# EAGLE design wmrp (EAGLE 7.7.0)
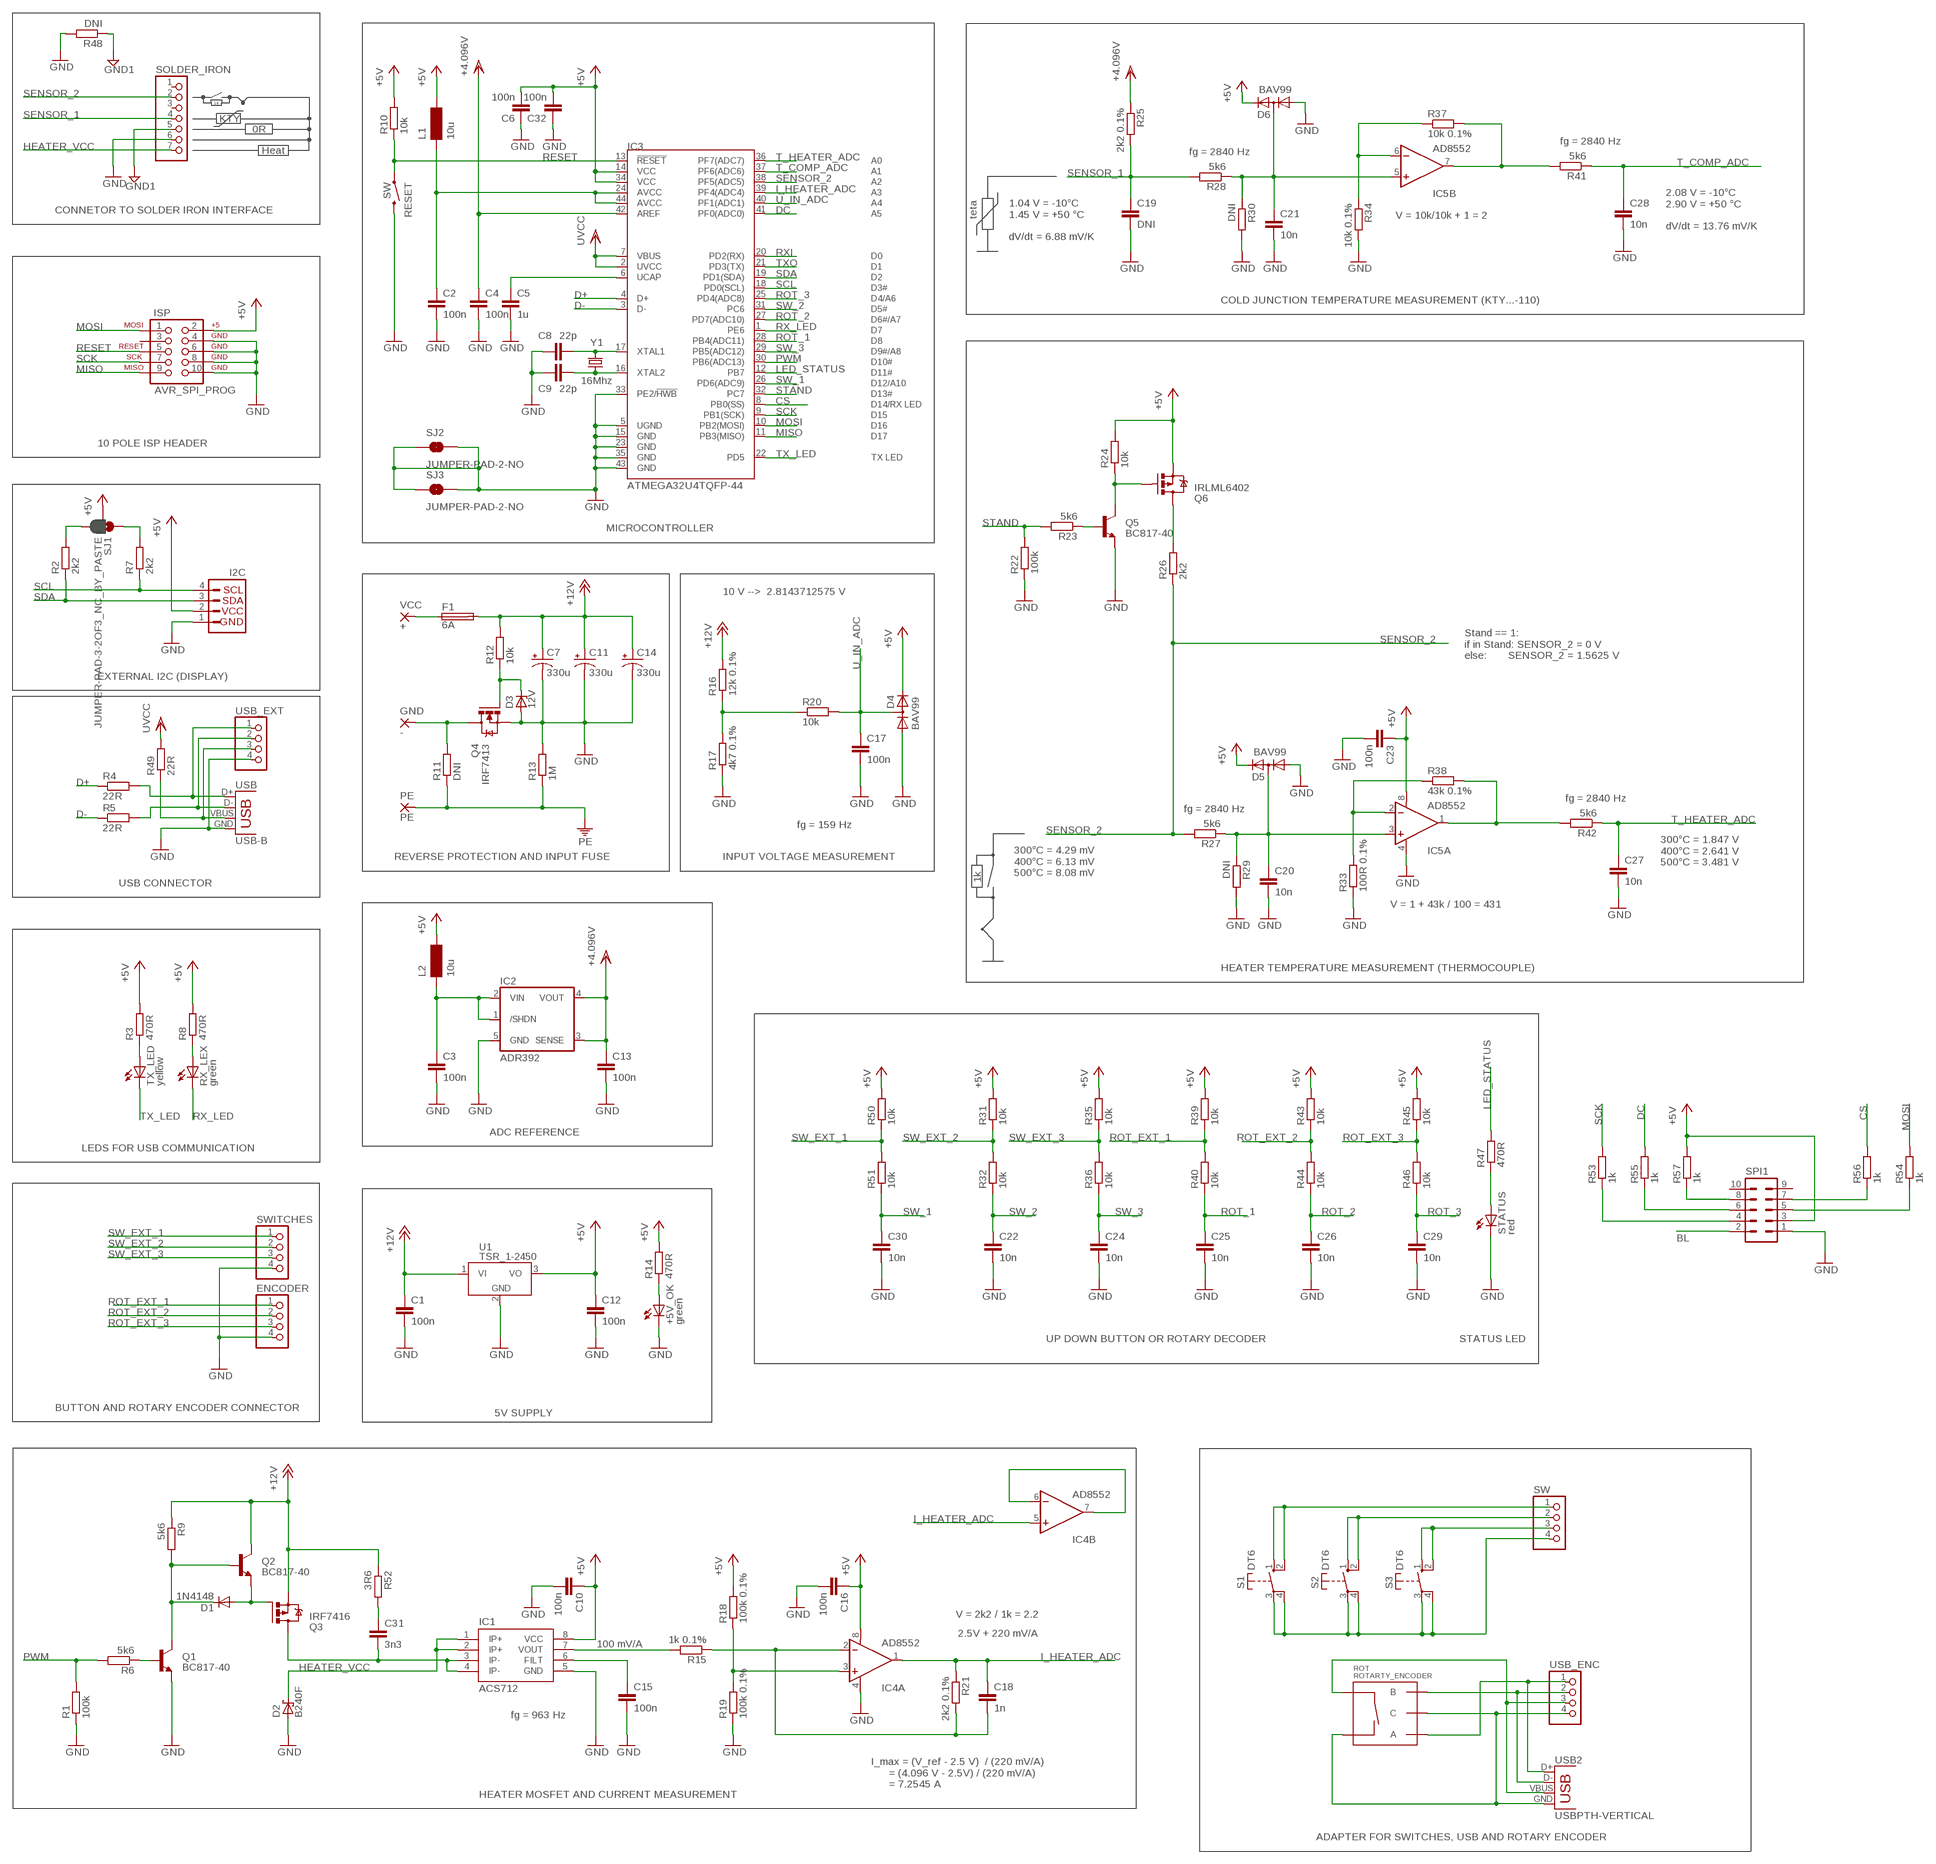
[diagram p0: schematic, sheet 1]

## Parts
+5V_OK  green  LEDCHIPLED_1206  [CHIPLED_1206]
C1  100n  C-EUC1206  [C1206]
C2  100n  C-EUC1206  [C1206]
C3  100n  C-EUC1206  [C1206]
C4  100n  C-EUC1206  [C1206]
C5  1u  C-EUC1206  [C1206]
C6  100n  C-EUC1206  [C1206]
C7  330u  CAP_POLPTH4  [CPOL-RADIAL-1000UF-25V]
C8  22p  C-EUC1206  [C1206]
C9  22p  C-EUC1206  [C1206]
C10  100n  C-EUC1206  [C1206]
C11  330u  CAP_POLPTH4  [CPOL-RADIAL-1000UF-25V]
C12  100n  C-EUC1206  [C1206]
C13  100n  C-EUC1206  [C1206]
C14  330u  CAP_POLPTH4  [CPOL-RADIAL-1000UF-25V]
C15  100n  C-EUC1206  [C1206]
C16  100n  C-EUC1206  [C1206]
C17  100n  C-EUC1206  [C1206]
C18  1n  C-EUC1206  [C1206]
C19  DNI  C-EUC1206  [C1206]
C20  10n  C-EUC1206  [C1206]
C21  10n  C-EUC1206  [C1206]
C22  10n  C-EUC1206  [C1206]
C23  100n  C-EUC1206  [C1206]
C24  10n  C-EUC1206  [C1206]
C25  10n  C-EUC1206  [C1206]
C26  10n  C-EUC1206  [C1206]
C27  10n  C-EUC1206  [C1206]
C28  10n  C-EUC1206  [C1206]
C29  10n  C-EUC1206  [C1206]
C30  10n  C-EUC1206  [C1206]
C31  3n3  C-EUC1206  [C1206]
C32  100n  C-EUC1206  [C1206]
D1  1N4148  DIODE-MINIMELF  [MINIMELF]
D2  B240F  MBRS130LT3  [SMB]
D3  12V  ZENER-DIODESOT23  [SOT23]
D4  BAV99  [SOT23]
D5  BAV99  [SOT23]
D6  BAV99  [SOT23]
ENCODER  PINHD-1X4  [1X04]
F1  6A  SH22,5  [SH22,5]
GND  -  2,54/1,0  [2,2]
I2C  I2C_STANDARD  [1X04]
IC1  ACS712  [SO08]
IC2  ADR392  [SOT23-5]
IC3  ATMEGA32U4TQFP-44  [TQFP44]
IC4  AD8552  OPAMP-DUALU  [SO08]
IC5  AD8552  OPAMP-DUALU  [SO08]
ISP  AVR_SPI_PROG  [AVR_ICSP]
L1  10u  INDUCTOR1206H*  [INDUCTOR-1206]
L2  10u  INDUCTOR1206H*  [INDUCTOR-1206]
PE  PE  2,54/1,0  [2,2]
Q1  BC817-40  TRANSISTOR_NPNSOT23-3  [SOT23-3]
Q2  BC817-40  TRANSISTOR_NPNSOT23-3  [SOT23-3]
Q3  IRF7416  [SO-08]
Q4  IRF7413  [SO-08]
Q5  BC817-40  TRANSISTOR_NPNSOT23-3  [SOT23-3]
Q6  IRLML6402  MOSFET-PCHANNELSMD  [SOT23-3]
R1  100k  R-EU_R1206  [R1206]
R2  2k2  R-EU_R1206  [R1206]
R3  470R  R-EU_R1206  [R1206]
R4  22R  R-EU_R1206  [R1206]
R5  22R  R-EU_R1206  [R1206]
R6  5k6  R-EU_M1206  [M1206]
R7  2k2  R-EU_R1206  [R1206]
R8  470R  R-EU_R1206  [R1206]
R9  5k6  R-EU_M1206  [M1206]
R10  10k  R-EU_R1206  [R1206]
R11  DNI  R-EU_R1206  [R1206]
R12  10k  R-EU_R1206  [R1206]
R13  1M  R-EU_R1206  [R1206]
R14  470R  R-EU_R1206  [R1206]
R15  1k 0.1%  R-EU_M1206  [M1206]
R16  12k 0.1%  R-EU_R1206  [R1206]
R17  4k7 0.1%  R-EU_R1206  [R1206]
R18  100k 0.1%  R-EU_M1206  [M1206]
R19  100k 0.1%  R-EU_M1206  [M1206]
R20  10k  R-EU_R1206  [R1206]
R21  2k2 0.1%  R-EU_M1206  [M1206]
R22  100k  R-EU_R1206  [R1206]
R23  5k6  R-EU_M1206  [M1206]
R24  10k  R-EU_R1206  [R1206]
R25  2k2 0.1%  R-EU_M1206  [M1206]
R26  2k2  R-EU_R1206  [R1206]
R27  5k6  R-EU_M1206  [M1206]
R28  5k6  R-EU_M1206  [M1206]
R29  DNI  R-EU_M1206  [M1206]
R30  DNI  R-EU_M1206  [M1206]
R31  10k  R-EU_R1206  [R1206]
R32  10k  R-EU_R1206  [R1206]
R33  100R 0.1%  R-EU_M1206  [M1206]
R34  10k 0.1%  R-EU_M1206  [M1206]
R35  10k  R-EU_R1206  [R1206]
R36  10k  R-EU_R1206  [R1206]
R37  10k 0.1%  R-EU_M1206  [M1206]
R38  43k 0.1%  R-EU_M1206  [M1206]
R39  10k  R-EU_R1206  [R1206]
R40  10k  R-EU_R1206  [R1206]
R41  5k6  R-EU_M1206  [M1206]
R42  5k6  R-EU_M1206  [M1206]
R43  10k  R-EU_R1206  [R1206]
R44  10k  R-EU_R1206  [R1206]
R45  10k  R-EU_R1206  [R1206]
R46  10k  R-EU_R1206  [R1206]
R47  470R  R-EU_R1206  [R1206]
R48  DNI  R-EU_R1206  [R1206]
R49  22R  R-EU_R1206  [R1206]
R50  10k  R-EU_R1206  [R1206]
R51  10k  R-EU_R1206  [R1206]
R52  3R6  R-EU_M1206  [M1206]
R53  1k  R-EU_R1206  [R1206]
R54  1k  R-EU_R1206  [R1206]
R55  1k  R-EU_R1206  [R1206]
R56  1k  R-EU_R1206  [R1206]
R57  1k  R-EU_R1206  [R1206]
RESET  SW  SWITCH-MOMENTARY-2PTH  [TACTILE-PTH]
ROT  ROTARTY_ENCODER  [ROTARY_ENC_PLAIN]
RX_LEX  green  LEDCHIPLED_1206  [CHIPLED_1206]
S1  DT6  [DT6]
S2  DT6  [DT6]
S3  DT6  [DT6]
SJ1  JUMPER-PAD-3-2OF3_NC_BY_PASTE  [PAD-JUMPER-3-2OF3_NC_BY_PASTE_YES_SILK_FULL_BOX]
SJ2  JUMPER-PAD-2-NO  [PAD-JUMPER-2-NO_NO_SILK]
SJ3  JUMPER-PAD-2-NO  [PAD-JUMPER-2-NO_NO_SILK]
SOLDER_IRON  PINHD-1X7  [1X07]
SPI1  MA05-2  [MA05-2]
STATUS  red  LEDCHIPLED_1206  [CHIPLED_1206]
SW  PINHD-1X4  [1X04]
SWITCHES  PINHD-1X4  [1X04]
TX_LED  yellow  LEDCHIPLED_1206  [CHIPLED_1206]
U1  TSR_1-2450  [TSR-1]
USB  USB-B  USBPTH  [USB-B-PTH]
USB2  USBPTH-VERTICAL  [USB-B-PTH-VERTICAL]
USB_ENC  PINHD-1X4  [1X04]
USB_EXT  PINHD-1X4  [1X04]
VCC  +  2,54/1,0  [2,2]
Y1  16Mhz  CRYSTALHC49US  [HC49US]

## Nets
+4.096V: C4.1 C13.1 IC2.3(SENSE) IC2.4(VOUT) IC3.42(AREF) R25.1
+5V: C6.2 C10.1 C12.1 C16.1 C23.1 C32.2 D4.2(C2) D5.2(C2) D6.2(C2) I2C.2 IC1.8(VCC) IC3.14(VCC) IC3.34(VCC) IC4.8(A:V+) IC5.8(A:V+) ISP.2 L1.P$1 L2.P$1 Q6.2(S) R3.2 R8.2 R10.2 R14.2 R18.2 R24.2 R31.2 R35.2 R39.2 R43.2 R45.2 R50.2 R57.2 SJ1.2 SPI1.3 U1.3(VO)
+12V: C1.1 C7.1(+) C11.1(+) C14.1(+) F1.2 Q2.3(C) Q3.1(S) Q3.2(S) Q3.3(S) R9.1 R12.2 R16.2 R52.1 U1.1(VI)
AVCC: C2.1 IC3.24(AVCC) IC3.44(AVCC) L1.P$2
BL: SPI1.2
CS: IC3.8(PB0(SS)) R56.2
D+: IC3.4(D+) R4.1
D-: IC3.3(D-) R5.1
DC: IC3.41(PF0(ADC0)) R55.2
GND: +5V_OK.C C1.2 C2.2 C3.2 C4.2 C5.2 C6.1 C7.2(-) C8.1 C9.1 C10.2 C11.2(-) C12.2 C13.2 C14.2(-) C15.2 C16.2 C17.2 C19.2 C20.2 C21.2 C22.2 C23.2 C24.2 C25.2 C26.2 C27.2 C28.2 C29.2 C30.2 C32.1 D2.A D3.1(A) D4.1(A1) D5.1(A1) D6.1(A1) ENCODER.4 I2C.1 IC1.5(GND) IC2.5(GND) IC3.5(UGND) IC3.15(GND) IC3.23(GND) IC3.33(PE2/!HWB) IC3.35(GND) IC3.43(GND) IC4.4(A:V-) IC5.4(A:V-) ISP.4 ISP.6 ISP.8 ISP.10 Q1.2(E) Q4.1(S) Q4.2(S) Q4.3(S) Q5.2(E) R1.1 R13.2 R17.1 R19.1 R22.1 R29.2 R30.2 R33.1 R34.2 R48.2 RESET.3 SJ2.1 SJ2.2 SJ3.1 SJ3.2 SOLDER_IRON.6 SPI1.1 STATUS.C SWITCHES.4 U1.2(GND) USB.GND USB_EXT.4
GND1: R48.1 SOLDER_IRON.5
HEATER_VCC: D2.C IC1.1(IP+) IC1.2(IP+) SOLDER_IRON.7
I_HEATER_ADC: C18.1 IC3.39(PF4(ADC4)) IC4.1(A:OUT) IC4.5(B:+IN) R21.1
LED_STATUS: IC3.12(PB7) R47.2
MISO: IC3.11(PB3(MISO)) ISP.9
MOSI: IC3.10(PB2(MOSI)) ISP.1 R54.2
N$1: GND.1(P) Q4.5(D) Q4.6(D) Q4.7(D) Q4.8(D) R11.2
N$2: D3.3(C) Q4.4(G) R12.1
N$3: D1.C Q1.3(C) Q2.1(B) R9.2
N$4: Q1.1(B) R6.1
N$5: F1.1 VCC.1(P)
N$6: R8.1 RX_LEX.A
N$7: S1.3(P) S1.4(P) S2.3(P) S2.4(P) S3.3(P) S3.4(P) SW.4
N$8: S1.1(S) S1.2(S) SW.1
N$9: R4.2 USB.D+ USB_EXT.1
N$10: R5.2 USB.D- USB_EXT.2
N$11: R16.1 R17.2 R20.1
N$12: S2.1(S) S2.2(S) SW.2
N$13: S3.1(S) S3.2(S) SW.3
N$14: R2.2 SJ1.3
N$15: Q5.3(C) Q6.1(G) R24.1
N$16: C15.1 IC1.6(FILT)
N$17: Q5.1(B) R23.1
N$18: IC4.3(A:+IN) R18.1 R19.2
N$19: R3.1 TX_LED.A
N$20: IC1.7(VOUT) R15.2
N$21: C18.2 IC4.2(A:-IN) R15.1 R21.2
N$22: C20.1 D5.3(C1A2) IC5.3(A:+IN) R27.1 R29.1
N$23: Q6.3(D) R26.2
N$24: IC5.2(A:-IN) R33.2 R38.1
N$25: C21.1 D6.3(C1A2) IC5.5(B:+IN) R28.1 R30.1
N$26: D1.A Q2.2(E) Q3.4(G)
N$27: IC5.6(B:-IN) R34.1 R37.1
N$28: C31.2 IC1.3(IP-) IC1.4(IP-) Q3.5(D) Q3.6(D) Q3.7(D) Q3.8(D)
N$29: R7.2 SJ1.1
N$30: C3.1 IC2.1(/SHDN) IC2.2(VIN) L2.P$2
N$31: R49.1 USB.VBUS USB_EXT.3
N$32: R47.1 STATUS.A
N$33: +5V_OK.A R14.1
N$34: IC4.6(B:-IN) IC4.7(B:OUT)
N$35: R53.1 SPI1.4
N$36: R54.1 SPI1.5
N$37: R55.1 SPI1.6
N$38: R56.1 SPI1.7
N$39: C31.1 R52.2
N$40: R57.1 SPI1.8
N$42: IC5.1(A:OUT) R38.2 R42.2
N$43: IC5.7(B:OUT) R37.2 R41.2
PE: PE.1(P) R11.1 R13.1
PWM: IC3.30(PB6(ADC13)) R1.2 R6.2
RESET: IC3.13(!RESET) ISP.5 R10.1 RESET.1
ROT_1: C25.1 IC3.28(PB4(ADC11)) R40.1
ROT_2: C26.1 IC3.27(PD7(ADC10)) R44.1
ROT_3: C29.1 IC3.25(PD4(ADC8)) R46.1
ROT_A_D+: ROT.A USB2.D+ USB_ENC.1
ROT_B_D-: ROT.B USB2.D- USB_ENC.2
ROT_C_GND: ROT.C ROT.SW- USB2.GND USB_ENC.4
ROT_EXT_1: ENCODER.1 R39.1 R40.2
ROT_EXT_2: ENCODER.2 R43.1 R44.2
ROT_EXT_3: ENCODER.3 R45.1 R46.2
ROT_SW_VBUS: ROT.SW+ USB2.VBUS USB_ENC.3
RX_LED: IC3.1(PE6) RX_LEX.C
RXI: IC3.20(PD2(RX))
SCK: IC3.9(PB1(SCK)) ISP.7 R53.2
SCL: I2C.4 IC3.18(PD0(SCL)) R7.1
SDA: I2C.3 IC3.19(PD1(SDA)) R2.1
SENSOR_1: C19.1 R25.2 R28.2 SOLDER_IRON.4
SENSOR_2: IC3.38(PF5(ADC5)) R26.1 R27.2 SOLDER_IRON.2
STAND: IC3.32(PC7) R22.2 R23.2
SW_1: C30.1 IC3.26(PD6(ADC9)) R51.1
SW_2: C22.1 IC3.31(PC6) R32.1
SW_3: C24.1 IC3.29(PB5(ADC12)) R36.1
SW_EXT_1: R50.1 R51.2 SWITCHES.1
SW_EXT_2: R31.1 R32.2 SWITCHES.2
SW_EXT_3: R35.1 R36.2 SWITCHES.3
T_COMP_ADC: C28.1 IC3.37(PF6(ADC6)) R41.1
T_HEATER_ADC: C27.1 IC3.36(PF7(ADC7)) R42.1
TX_LED: IC3.22(PD5) TX_LED.C
TXO: IC3.21(PD3(TX))
U_IN_ADC: C17.1 D4.3(C1A2) IC3.40(PF1(ADC1)) R20.2
UCAP: C5.1 IC3.6(UCAP)
UVCC: IC3.2(UVCC) IC3.7(VBUS) R49.2
XTAL1: C8.2 IC3.17(XTAL1) Y1.2
XTAL2: C9.2 IC3.16(XTAL2) Y1.1
Unconnected: ISP.3 SOLDER_IRON.1 SOLDER_IRON.3 SPI1.9 SPI1.10

## Notes on the sheet
- 1k
- KTY
- 0R
- fg = 2840 Hz
- Heat | fg = 2840 Hz
- CONNETOR TO SOLDER IRON INTERFACE
- teta | V = 10k/10k + 1 = 2
- 2.08 V = -10°C
  2.90 V = +50 °C
  
  dV/dt = 13.76 mV/K
- 1.04 V = -10°C
  1.45 V = +50 °C
  
  dV/dt = 6.88 mV/K
- COLD JUNCTION TEMPERATURE MEASUREMENT (KTY...-110)
- 10 POLE ISP HEADER
- MICROCONTROLLER
- 10 V -->  2.8143712575 V
- Stand == 1:
  if in Stand: SENSOR_2 = 0 V
  else:       SENSOR_2 = 1.5625 V
- EXTERNAL I2C (DISPLAY)
- fg = 2840 Hz
- fg = 2840 Hz
- fg = 159 Hz
- REVERSE PROTECTION AND INPUT FUSE | INPUT VOLTAGE MEASUREMENT
- 300°C = 1.847 V
  400°C = 2.641 V
  500°C = 3.481 V
- 300°C = 4.29 mV
  400°C = 6.13 mV
  500°C = 8.08 mV
- 1k
- USB CONNECTOR
- V = 1 + 43k / 100 = 431
- HEATER TEMPERATURE MEASUREMENT (THERMOCOUPLE)
- ADC REFERENCE
- LEDS FOR USB COMMUNICATION
- UP DOWN BUTTON OR ROTARY DECODER | STATUS LED
- BUTTON AND ROTARY ENCODER CONNECTOR
- 5V SUPPLY
- V = 2k2 / 1k = 2.2
- 2.5V + 220 mV/A
- 100 mV/A
- fg = 963 Hz
- I_max = (V_ref - 2.5 V)  / (220 mV/A)
        = (4.096 V - 2.5V) / (220 mV/A)
        = 7.2545 A
- HEATER MOSFET AND CURRENT MEASUREMENT
- ADAPTER FOR SWITCHES, USB AND ROTARY ENCODER

## Library data of the parts
+5V_OK RX_LEX = led:LED: LED OSRAM: - CHIPLED LG R971, LG N971, LY N971, LG Q971, LY Q971, LO R971, LY R971 LH N974, LH R974 LS Q976, LO Q976, LY Q976 LO Q996 - Hyper CHIPLED LW Q18S LB Q993, LB Q99A, LB R99A - SideLED LS A670, LO A670, LY A670, LG A670, LP A670 LB A673, LV A673, LT A673, LW A673 LH A674 LY A675 LS A676, LA A676, LO A676, LY A676, LW A676 LS A679, LY A679, LG A679 - Hyper Micro SIDELED® LS Y876, LA Y876, LO Y876, LY Y876 LT Y87S - SmartLED LW L88C, LW L88S LB L89C, LB L89S, LG L890 LS L89K, LO L89K, LY L89K LS L896, LA L896, LO L896, LY L896 - TOPLED LS T670, LO T670, LY T670, LG T670, LP T670 LSG T670, LSP T670, LSY T670, LOP T670, LYG T670 LG T671, LOG T671, LSG T671 LB T673, LV T673, LT T673, LW T673 LH T674 LS T676, LA T676, LO T676, LY T676, LB T676, LH T676, LSB T676, LW T676 LB T67C, LV T67C, LT T67C, LS T67K, LO T67K, LY T67K, LW E67C LS E67B, LA E67B, LO E67B, LY E67B, LB E67C, LV E67C, LT E67C LW T67C LS T679, LY T679, LG T679 LS T770, LO T770, LY T770, LG T770, LP T770 LB T773, LV T773, LT T773, LW T773 LH T774 LS E675, LA E675, LY E675, LS T675 LS T776, LA T776, LO T776, LY T776, LB T776 LHGB T686 LT T68C, LB T68C - Hyper Mini TOPLED® LB M676 - Mini TOPLED Santana® LG M470 LS M47K, LO M47K, LY M47K Source: http://www.osram.convergy.de LUXEON: - LUMILED® LXK2-PW12-R00, LXK2-PW12-S00, LXK2-PW14-U00, LXK2-PW14-V00 LXK2-PM12-R00, LXK2-PM12-S00, LXK2-PM14-U00 LXK2-PE12-Q00, LXK2-PE12-R00, LXK2-PE12-S00, LXK2-PE14-T00, LXK2-PE14-U00 LXK2-PB12-K00, LXK2-PB12-L00, LXK2-PB12-M00, LXK2-PB14-N00, LXK2-PB14-P00, LXK2-PB14-Q00 LXK2-PR12-L00, LXK2-PR12-M00, LXK2-PR14-Q00, LXK2-PR14-R00 LXK2-PD12-Q00, LXK2-PD12-R00, LXK2-PD12-S00 LXK2-PH12-R00, LXK2-PH12-S00 LXK2-PL12-P00, LXK2-PL12-Q00, LXK2-PL12-R00 Source: www.luxeon.com KINGBRIGHT: KA-3528ASYC Source: www.kingbright.com; REICHELT: SMD-LED 1206 GN
C1-C4 C6 C12 C13 C17 C32 = resistor:C-EU: CAPACITOR, European symbol; REICHELT: X7R-G1206 100N
C5 = resistor:C-EU: CAPACITOR, European symbol; REICHELT: X7R-G1206 1,0/50
C7 C11 C14 = SparkFun-Passives:CAP_POL: Capacitor Polarized These are standard SMD and PTH capacitors. Normally 10uF, 47uF, and 100uF in electrolytic and tantalum varieties. Always verify the external diameter of the through hole cap, it varies with capacity, voltage, and manufacturer. The EIA devices should be standard.; REICHELT: RAD FC 330/25
C8 C9 = resistor:C-EU: CAPACITOR, European symbol; REICHELT: NPO-G1206 22P
C10 C15 C16 C23 = rcl:C-EU: CAPACITOR, European symbol; REICHELT: X7R-G1206 100N
C18 = rcl:C-EU: CAPACITOR, European symbol; REICHELT: NPO-G1206 1,0N
C19 = rcl:C-EU: CAPACITOR, European symbol; REICHELT: -
C20-C22 C24-C30 = rcl:C-EU: CAPACITOR, European symbol; REICHELT: X7R-G1206 10N
C31 = resistor:C-EU: CAPACITOR, European symbol; REICHELT: X7R-G1206 3,3N
D1 = diode:DIODE-: DIODE; REICHELT: 1N 4148 SMD
D2 = diode:MBRS130LT3: Schottky Power Rectifier Source: http://www.onsemi.com/pub/Collateral/MBRS130LT3-D.PDF; REICHELT: B 240 F
D3 = diode:ZENER-DIODE: Z-Diode; REICHELT: SMD ZD 12
D4-D6 = BAV99:BAV99: Small Signal Diode Source: http://www.fairchildsemi.com/ds/BA/BAV99.pdf; REICHELT: BAV 99 SMD
ENCODER SW SWITCHES USB_ENC USB_EXT = pinhead:PINHD-1X4: PIN HEADER; REICHELT: MPE 087-1-004
F1 = fuse:SH22,5: FUSE HOLDER grid 22,5 mm, OGN0031 8201, Schurter (Buerklin); MF: SCHURTER; MPN: 0031.8201; OC_FARNELL: 1162740; OC_NEWARK: 96F8317; REICHELT: PL OGN-22,5
GND PE VCC = WIREPAD22:2,54/1,0: THROUGH-HOLE PAD; REICHELT: -
I2C = SparkFun-Connectors:I2C_STANDARD: SparkFun has standardized on a pinout for all I2C based sensor breakouts. This pinout allows I2C boards to be plugged directly into the headers on Arduino Uno compatible boards, and to be daisy chained easily.; REICHELT: MPE 087-1-004
IC1 = SparkFun-AnalogIC:ACS712: Hall-effect-based isolated linear current sensor
IC2 = wmrp:ADR392: http://www.analog.com/media/en/technical-documentation/data-sheets/ADR391_392_395.pdf; CONRAD: 1250814 - 62; VOELKNER: A376911
IC3 = SparkFun-DigitalIC:ATMEGA32U4: Atmel 44-pin 8-bit Microcontroller with 32KBytes of ISP Flash and USB Controller; VOELKNER: A886841
IC4 IC5 = SparkFun-AnalogIC:OPAMP-DUAL: Generic op-amp footprint; REICHELT: AD 8552 AR
ISP = SparkFun-Connectors:AVR_SPI_PROG: AVR 10-pin ICSP Header This is the standard AVR In Circuit Serial Programming header. Minimal, but includes pin one indicator. Works with standard Olimex programmers. Also look for the 6-pin reduced version. Spark Fun Electronics SKU: PRT-00778; REICHELT: MPE 087-2-010
L1 L2 = wmrp:INDUCTOR: Inductors Basic Inductor/Choke - 0603 and 1206. Footprints are not proven and vary greatly between part numbers. SRN6045- 33uH, 20% 1.4A SDR0403-560KL - 56uH, 10%, 500mA RMS/740mA peak; REICHELT: L-1812AF 10µ
Q1 Q2 Q5 = SparkFun-DiscreteSemi:TRANSISTOR_NPN: Generic NPN BJT MMBT2222A - TRANS-08049 (SOT-23, 1A 40V) MPSA42 - TRANS-09116 (SOT-23, 500mA 300V) MMBT5088LT1G - TRANS-11160 (SOT-23, 50 mA 30V) BC547 - COM-08928 <http://www.sparkfun.com/products/8928> (TO-92 45V 100mA) (1.Collector 2.Base 3.Emitter) 2N3904 - COM-00521 <http://www.sparkfun.com/products/521> (TO-92 40V 200mA) (1.Emitter 2.Base 3.Collector) P2N2222A - COM-12852 <http://www.sparkfun.com/products/12852> (TO-92 40V 600mA) (1.Collector 2.Base 3.Emitter); PROD_ID: TRANS-08049; REICHELT: BC 817-40 SMD
Q3 = wmrp:IRF7416: P-Channel HEXFET® Power MOSFET http://www.irf.com/product-info/datasheets/data/irf7416.pdf; REICHELT: IRF 7416
Q4 = wmrp:IRF7413: N-Channel HEXFET® Power MOSFET http://www.irf.com/product-info/datasheets/data/irf7413.pdf; REICHELT: IRF 7413
Q6 = SparkFun-DiscreteSemi:MOSFET-PCHANNEL: Generic PMOSFET IRLML2244 - TRANS-11153 (SOT-23 -20V -4.3A) (1.Gate 2.Source 3.Drain) FQP27P06 - COM-10349 <http://www.sparkfun.com/products/10349> (TO-220 -60V -27A) (1.Gate 2.Source 3.Drain); REICHELT: IRLML 6402
R1 R22 = resistor:R-EU_: RESISTOR, European symbol; REICHELT: SMD 1/4W 100K
R2 R7 R26 = resistor:R-EU_: RESISTOR, European symbol; REICHELT: SMD 1/4W 2,2K
R3 R8 R14 R47 = resistor:R-EU_: RESISTOR, European symbol; REICHELT: SMD 1/4W 470
R4 R5 R49 = resistor:R-EU_: RESISTOR, European symbol; REICHELT: SMD 1/4W 22
R6 R9 R23 R27 R28 R41 R42 = rcl:R-EU_: RESISTOR, European symbol; REICHELT: SMD 1/4W 5,6K
R10 R12 R20 R24 R31 R32 R35 R36 R39 R40 R43-R46 R50 R51 = resistor:R-EU_: RESISTOR, European symbol; REICHELT: SMD 1/4W 10K
R11 R48 R53-R57 = resistor:R-EU_: RESISTOR, European symbol; REICHELT: -
R13 = resistor:R-EU_: RESISTOR, European symbol; REICHELT: SMD 1/4W 1,0M
R15 = rcl:R-EU_: RESISTOR, European symbol; REICHELT: SPR-1206 1,00K
R16 = resistor:R-EU_: RESISTOR, European symbol; REICHELT: SPR-1206 12,0K
R17 = resistor:R-EU_: RESISTOR, European symbol; REICHELT: SPR-1206 4,70K
R18 R19 = rcl:R-EU_: RESISTOR, European symbol; REICHELT: SPR-1206 100K
R21 R25 = rcl:R-EU_: RESISTOR, European symbol; REICHELT: SPR-1206 2,20K
R29 R30 = rcl:R-EU_: RESISTOR, European symbol; REICHELT: -
R33 = rcl:R-EU_: RESISTOR, European symbol; REICHELT: SPR-1206 100
R34 R37 = rcl:R-EU_: RESISTOR, European symbol; REICHELT: SPR-1206 10,0K
R38 = rcl:R-EU_: RESISTOR, European symbol; REICHELT: SPR-1206 43,0K
R52 = rcl:R-EU_: RESISTOR, European symbol; REICHELT: SMD 1/4W 3,6
RESET = SparkFun-Electromechanical:SWITCH-MOMENTARY-2: Various NO switches- pushbuttons, reed, etc; REICHELT: TASTER 9302
ROT = SparkFun-Electromechanical:ROTARTY_ENCODER: Simple no LED rotary encoder Example: COM-09117; VOELKNER: W32173
S1-S3 = switch-misc:DT: ITT SWITCH; VOELKNER: D76189
SJ1 = SparkFun-Passives:JUMPER-PAD-3-2OF3_NC_BY_PASTE; REICHELT: -
SJ2 SJ3 = SparkFun-Passives:JUMPER-PAD-2-NO; REICHELT: -
SOLDER_IRON = pinhead:PINHD-1X7: PIN HEADER; REICHELT: -
SPI1 = con-lstb:MA05-2: PIN HEADER; OC_FARNELL: unknown; OC_NEWARK: unknown
STATUS = led:LED: LED OSRAM: - CHIPLED LG R971, LG N971, LY N971, LG Q971, LY Q971, LO R971, LY R971 LH N974, LH R974 LS Q976, LO Q976, LY Q976 LO Q996 - Hyper CHIPLED LW Q18S LB Q993, LB Q99A, LB R99A - SideLED LS A670, LO A670, LY A670, LG A670, LP A670 LB A673, LV A673, LT A673, LW A673 LH A674 LY A675 LS A676, LA A676, LO A676, LY A676, LW A676 LS A679, LY A679, LG A679 - Hyper Micro SIDELED® LS Y876, LA Y876, LO Y876, LY Y876 LT Y87S - SmartLED LW L88C, LW L88S LB L89C, LB L89S, LG L890 LS L89K, LO L89K, LY L89K LS L896, LA L896, LO L896, LY L896 - TOPLED LS T670, LO T670, LY T670, LG T670, LP T670 LSG T670, LSP T670, LSY T670, LOP T670, LYG T670 LG T671, LOG T671, LSG T671 LB T673, LV T673, LT T673, LW T673 LH T674 LS T676, LA T676, LO T676, LY T676, LB T676, LH T676, LSB T676, LW T676 LB T67C, LV T67C, LT T67C, LS T67K, LO T67K, LY T67K, LW E67C LS E67B, LA E67B, LO E67B, LY E67B, LB E67C, LV E67C, LT E67C LW T67C LS T679, LY T679, LG T679 LS T770, LO T770, LY T770, LG T770, LP T770 LB T773, LV T773, LT T773, LW T773 LH T774 LS E675, LA E675, LY E675, LS T675 LS T776, LA T776, LO T776, LY T776, LB T776 LHGB T686 LT T68C, LB T68C - Hyper Mini TOPLED® LB M676 - Mini TOPLED Santana® LG M470 LS M47K, LO M47K, LY M47K Source: http://www.osram.convergy.de LUXEON: - LUMILED® LXK2-PW12-R00, LXK2-PW12-S00, LXK2-PW14-U00, LXK2-PW14-V00 LXK2-PM12-R00, LXK2-PM12-S00, LXK2-PM14-U00 LXK2-PE12-Q00, LXK2-PE12-R00, LXK2-PE12-S00, LXK2-PE14-T00, LXK2-PE14-U00 LXK2-PB12-K00, LXK2-PB12-L00, LXK2-PB12-M00, LXK2-PB14-N00, LXK2-PB14-P00, LXK2-PB14-Q00 LXK2-PR12-L00, LXK2-PR12-M00, LXK2-PR14-Q00, LXK2-PR14-R00 LXK2-PD12-Q00, LXK2-PD12-R00, LXK2-PD12-S00 LXK2-PH12-R00, LXK2-PH12-S00 LXK2-PL12-P00, LXK2-PL12-Q00, LXK2-PL12-R00 Source: www.luxeon.com KINGBRIGHT: KA-3528ASYC Source: www.kingbright.com; REICHELT: SMD-LED 1206 RT
TX_LED = led:LED: LED OSRAM: - CHIPLED LG R971, LG N971, LY N971, LG Q971, LY Q971, LO R971, LY R971 LH N974, LH R974 LS Q976, LO Q976, LY Q976 LO Q996 - Hyper CHIPLED LW Q18S LB Q993, LB Q99A, LB R99A - SideLED LS A670, LO A670, LY A670, LG A670, LP A670 LB A673, LV A673, LT A673, LW A673 LH A674 LY A675 LS A676, LA A676, LO A676, LY A676, LW A676 LS A679, LY A679, LG A679 - Hyper Micro SIDELED® LS Y876, LA Y876, LO Y876, LY Y876 LT Y87S - SmartLED LW L88C, LW L88S LB L89C, LB L89S, LG L890 LS L89K, LO L89K, LY L89K LS L896, LA L896, LO L896, LY L896 - TOPLED LS T670, LO T670, LY T670, LG T670, LP T670 LSG T670, LSP T670, LSY T670, LOP T670, LYG T670 LG T671, LOG T671, LSG T671 LB T673, LV T673, LT T673, LW T673 LH T674 LS T676, LA T676, LO T676, LY T676, LB T676, LH T676, LSB T676, LW T676 LB T67C, LV T67C, LT T67C, LS T67K, LO T67K, LY T67K, LW E67C LS E67B, LA E67B, LO E67B, LY E67B, LB E67C, LV E67C, LT E67C LW T67C LS T679, LY T679, LG T679 LS T770, LO T770, LY T770, LG T770, LP T770 LB T773, LV T773, LT T773, LW T773 LH T774 LS E675, LA E675, LY E675, LS T675 LS T776, LA T776, LO T776, LY T776, LB T776 LHGB T686 LT T68C, LB T68C - Hyper Mini TOPLED® LB M676 - Mini TOPLED Santana® LG M470 LS M47K, LO M47K, LY M47K Source: http://www.osram.convergy.de LUXEON: - LUMILED® LXK2-PW12-R00, LXK2-PW12-S00, LXK2-PW14-U00, LXK2-PW14-V00 LXK2-PM12-R00, LXK2-PM12-S00, LXK2-PM14-U00 LXK2-PE12-Q00, LXK2-PE12-R00, LXK2-PE12-S00, LXK2-PE14-T00, LXK2-PE14-U00 LXK2-PB12-K00, LXK2-PB12-L00, LXK2-PB12-M00, LXK2-PB14-N00, LXK2-PB14-P00, LXK2-PB14-Q00 LXK2-PR12-L00, LXK2-PR12-M00, LXK2-PR14-Q00, LXK2-PR14-R00 LXK2-PD12-Q00, LXK2-PD12-R00, LXK2-PD12-S00 LXK2-PH12-R00, LXK2-PH12-S00 LXK2-PL12-P00, LXK2-PL12-Q00, LXK2-PL12-R00 Source: www.luxeon.com KINGBRIGHT: KA-3528ASYC Source: www.kingbright.com; REICHELT: SMD-LED 1206 GE
U1 = traco_tsr-1:TSR_1-*; REICHELT: TSR 1-2450
USB = SparkFun-Connectors:USB: USB Connectors USB-B-PTH is fully proven SKU : PRT-00139/CONN-08278 USB-miniB is fully proven SKU : PRT-00587 USB-A-PCB is untested. USB-A-H is throughly reviewed, but untested. Spark Fun Electronics SKU : PRT-00437 USB-B-SMT is throughly reviewed, but untested. Needs silkscreen touching up. USB-A-S has not been used/tested USB-MB-H has not been used/tested USB-MICROB has been used. CONN-09505; PROD_ID: CONN-08278; REICHELT: USB BW
USB2 = wmrp:USB: USB Connectors USB-B-PTH is fully proven SKU : PRT-00139/CONN-08278 USB-miniB is fully proven SKU : PRT-00587 USB-A-PCB is untested. USB-A-H is throughly reviewed, but untested. Spark Fun Electronics SKU : PRT-00437 USB-B-SMT is throughly reviewed, but untested. Needs silkscreen touching up. USB-A-S has not been used/tested USB-MB-H has not been used/tested USB-MICROB has been used. CONN-09505; REICHELT: USB BG
Y1 = SparkFun-FreqCtrl:CRYSTAL: Various standard crystals. Proven footprints.; REICHELT: 16,0000-HC49U-S

## Board
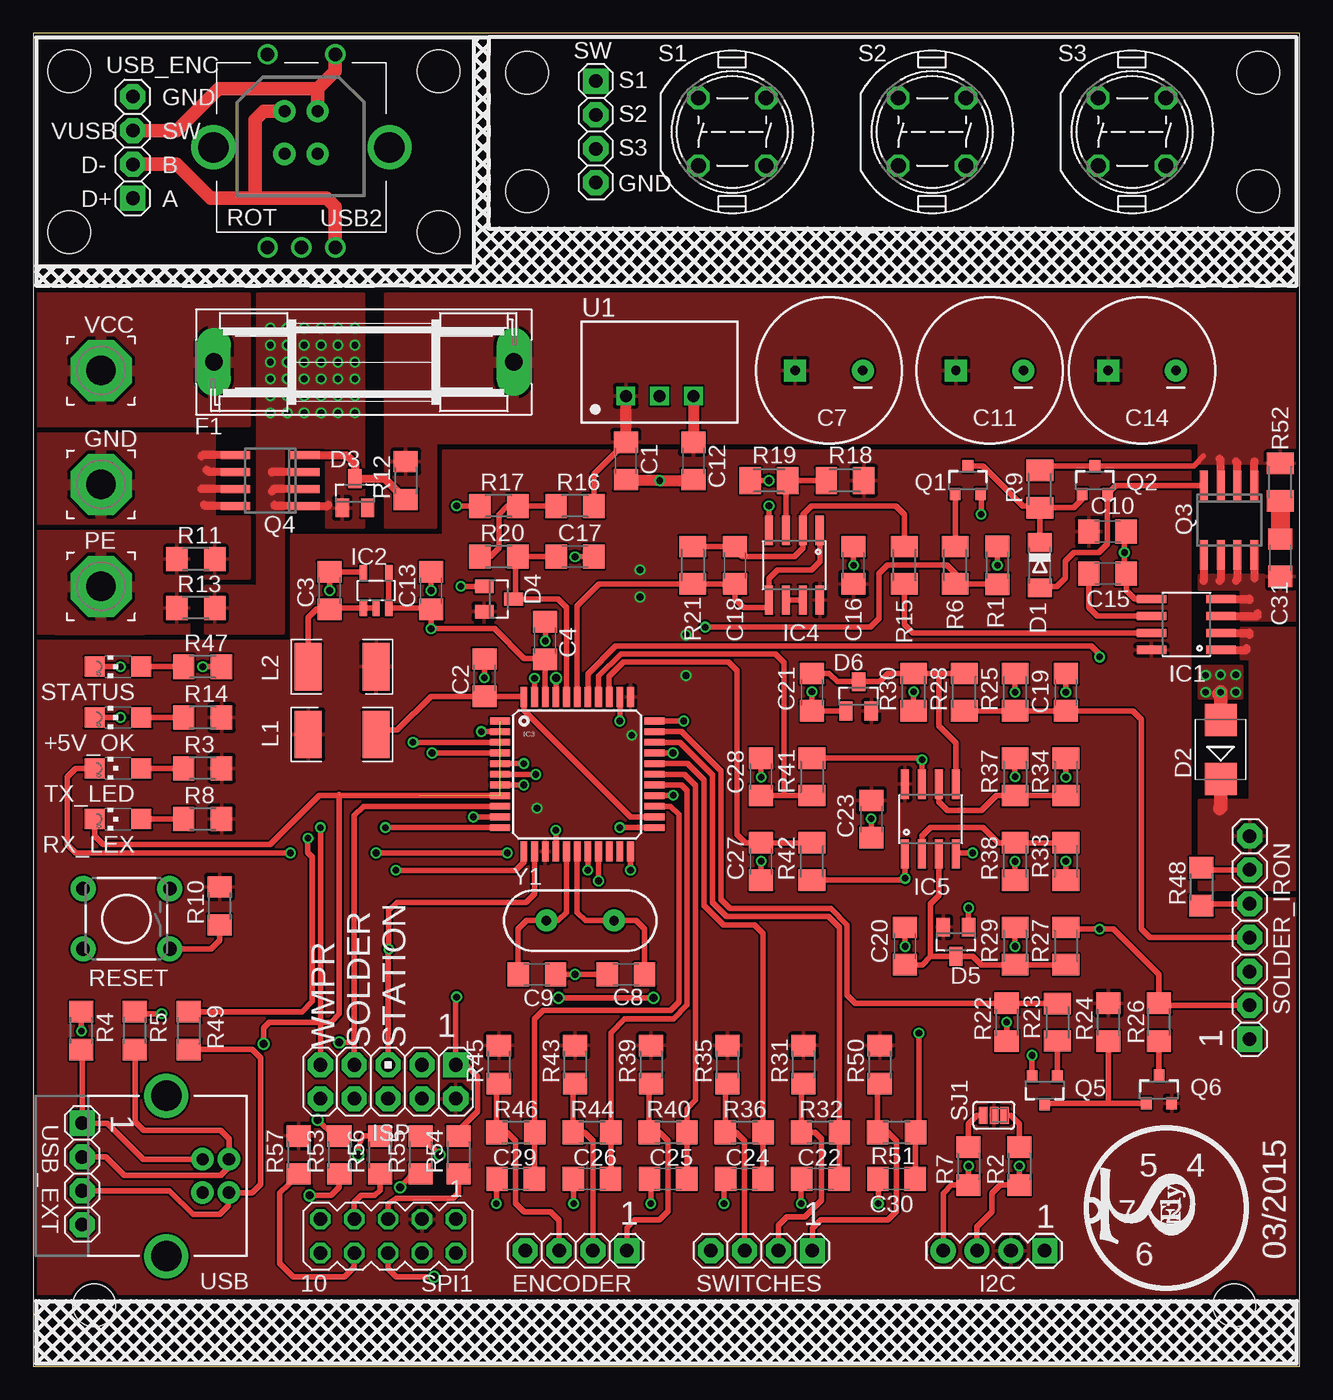
[diagram p1: board, top side]
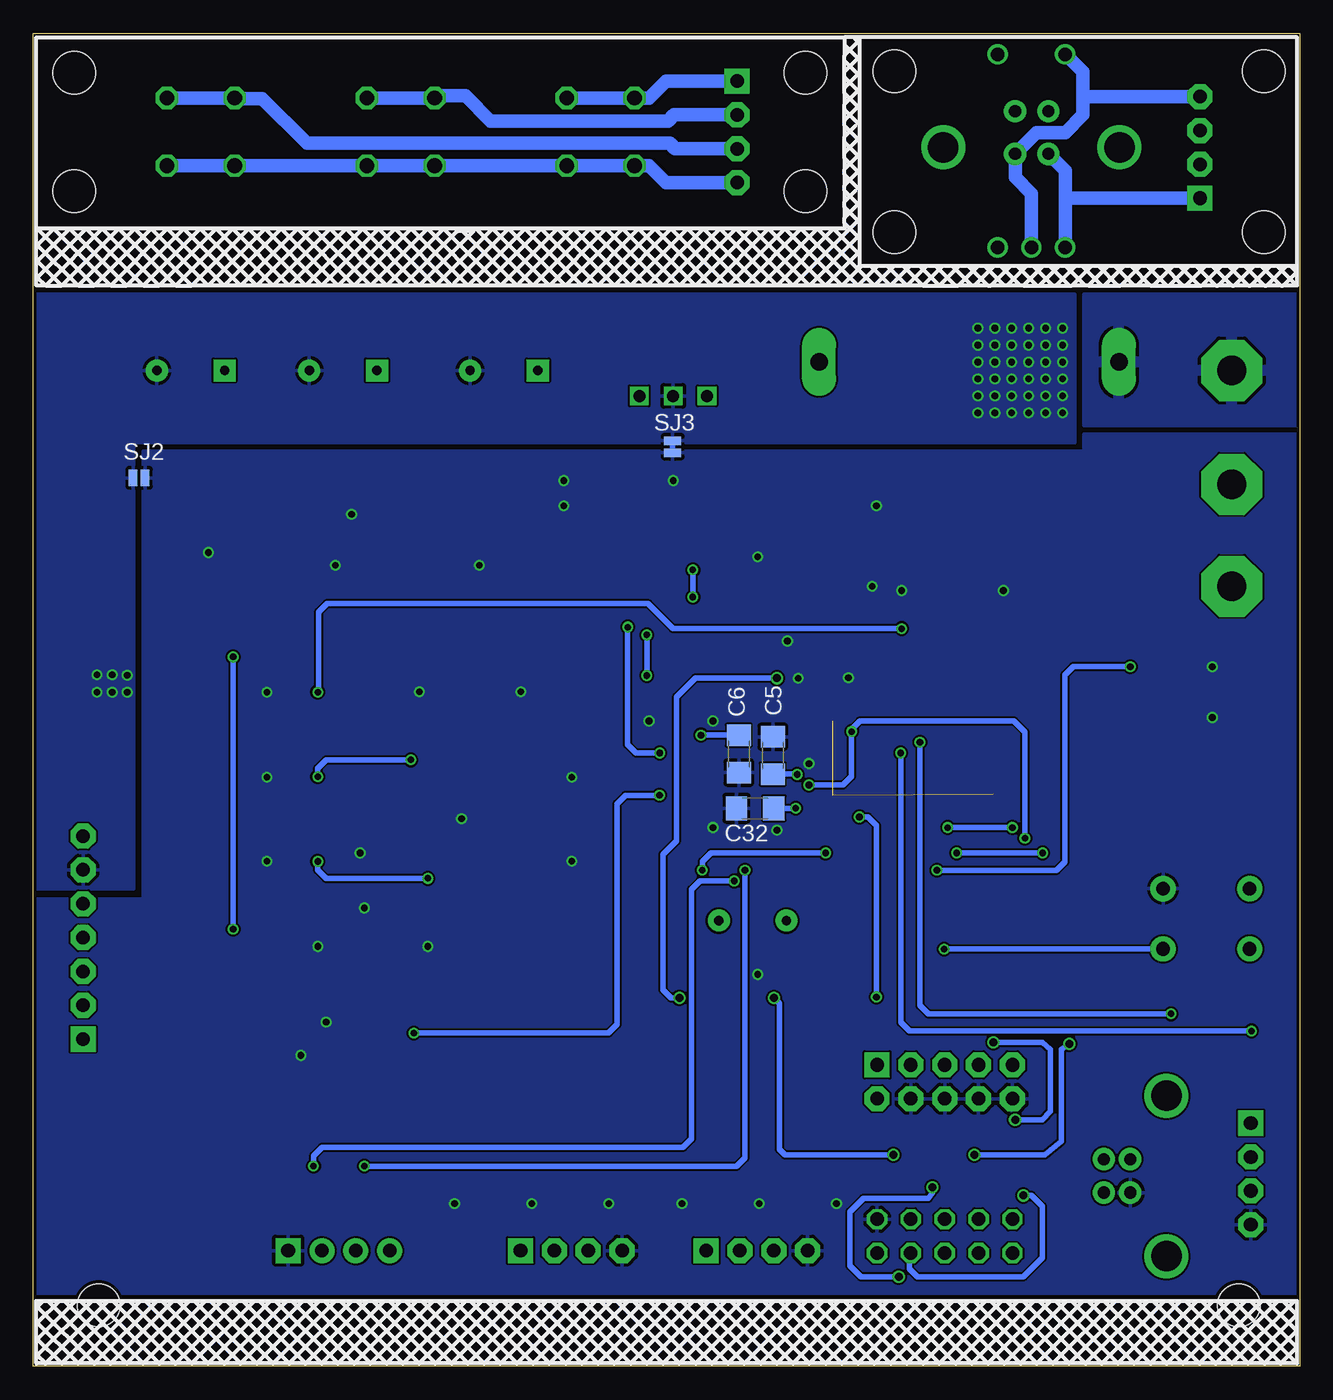
[diagram p2: board, bottom side, seen from below]

Size 95 x 100 mm. Coordinates in mm from the lower left corner, seen from the top.
Outline: 0,0 95,0 95,100 0,100 0,0
Copper layers (1*16): Top 0.035mm / dielectric 1.5mm / Bottom 0.035mm
Design rules "Elecrow_2-layer_eagle_rule": minimum track width 6mil, minimum drill 12mil, track to track 6mil, track to pad 6mil, pad to pad 6mil, via to via 6mil, smd to smd 0mil, copper to edge 10mil, drill to drill 10mil, minimum pad ring 10mil, minimum via ring 6mil, stop-mask expansion 2mil, vias tented up to drill 100mil, thermal gap 10mil
Holes 3.2 mm at 37.06,97.05 2.68,97.16 90.09,4.57 4.57,4.57 91.92,97.05 30.4,97.16 37.06,88.16 30.4,85.09 2.68,85.09 91.92,88.16

### Footprints (pad centres in the part's own frame; a part is rotated, then mirrored left to right if it is on the bottom)
CHIPLED_1206 = smd 1.5 x 1.5: A 0,-1.75; C 0,1.75
C1206 = smd 1.6 x 1.8: 1 -1.4,0; 2 1.4,0
CPOL-RADIAL-1000UF-25V = drill 0.7 pad 1.651 square: 1 2.54,0 | drill 0.7 pad 1.651: 2 -2.54,0
MINIMELF = smd 1.4 x 1.8: A 1.7,0; C -1.7,0
SMB = smd 2.4 x 2.4: A 2.2,0; C -2.2,0
SOT23 = smd 1 x 1.4: 1 -0.95,-1.1; 2 0.95,-1.1; 3 0,1.1
1X04 = drill 1.016 pad 1.88 square: 1 -3.81,0 | drill 1.016 pad 1.88 octagon: 2 -1.27,0; 3 1.27,0; 4 3.81,0
SH22,5 = drill 1.321 pad 2.54 long: 1 -11.252,0; 2 11.252,0
2,2 = drill 2.2 pad 4.572 octagon: 1 0,0
1X04' = drill 1.016 pad 1.88 square: 1 0,0 | drill 1.016 pad 1.88: 2 2.54,0; 3 5.08,0; 4 7.62,0
SO08 = smd 0.61 x 2.21: 1 -1.905,-2.616; 2 -0.635,-2.616; 3 0.635,-2.616; 4 1.905,-2.616; 5 1.905,2.616; 6 0.635,2.616; 7 -0.635,2.616; 8 -1.905,2.616
SOT23-5 = smd 0.55 x 1.2: 1 -0.95,-1.3; 2 0,-1.3; 3 0.95,-1.3; 4 0.95,1.3; 5 -0.95,1.3
TQFP44 = smd 1.5 x 0.5: 1 -5.8,4; 2 -5.8,3.2; 3 -5.8,2.4; 4 -5.8,1.6; 5 -5.8,0.8; 6 -5.8,0; 7 -5.8,-0.8; 8 -5.8,-1.6; 9 -5.8,-2.4; 10 -5.8,-3.2; 11 -5.8,-4; 23 5.8,-4; 24 5.8,-3.2; 25 5.8,-2.4; 26 5.8,-1.6; 27 5.8,-0.8; 28 5.8,0; 29 5.8,0.8; 30 5.8,1.6; 31 5.8,2.4; 32 5.8,3.2; 33 5.8,4 | smd 0.5 x 1.5: 12 -4,-5.8; 13 -3.2,-5.8; 14 -2.4,-5.8; 15 -1.6,-5.8; 16 -0.8,-5.8; 17 0,-5.8; 18 0.8,-5.8; 19 1.6,-5.8; 20 2.4,-5.8; 21 3.2,-5.8; 22 4,-5.8; 34 4,5.8; 35 3.2,5.8; 36 2.4,5.8; 37 1.6,5.8; 38 0.8,5.8; 39 0,5.8; 40 -0.8,5.8; 41 -1.6,5.8; 42 -2.4,5.8; 43 -3.2,5.8; 44 -4,5.8
AVR_ICSP = drill 1.016 pad 1.88 square: 1 -1.27,5.08 | drill 1.016 pad 1.88 octagon: 2 1.27,5.08; 3 -1.27,2.54; 4 1.27,2.54; 5 -1.27,0; 6 1.27,0; 7 -1.27,-2.54; 8 1.27,-2.54; 9 -1.27,-5.08; 10 1.27,-5.08
INDUCTOR-1206 = smd 2.032 x 3.556: P$1 -2.54,0; P$2 2.54,0
SOT23-3 = smd 0.8 x 0.9: 1 -0.95,-1; 2 0.95,-1; 3 0,1.1
SO-08 = smd 0.6 x 2.2: 1 -1.905,-2.6; 2 -0.635,-2.6; 3 0.635,-2.6; 4 1.905,-2.6; 5 1.905,2.6; 6 0.635,2.6; 7 -0.635,2.6; 8 -1.905,2.6
R1206 = smd 1.6 x 1.803: 1 -1.422,0; 2 1.422,0
M1206 = smd 1.6 x 2: 1 -1.4,0; 2 1.4,0
TACTILE-PTH = drill 1.016 pad 1.88: 1 -3.251,2.261; 2 3.251,2.261; 3 -3.251,-2.261; 4 3.251,-2.261
ROTARY_ENC_PLAIN = drill 1.016: A 7.493,-2.54; B 7.493,2.54; C 7.493,0; SW+ -6.985,2.54; SW- -6.985,-2.54 | drill 2.286: P$3 0,6.604; P$4 0,-6.604
DT6 = drill 1.118 octagon: 1 -2.54,2.54; 2 2.54,2.54; 3 2.54,-2.54; 4 -2.54,-2.54
PAD-JUMPER-3-2OF3_NC_BY_PASTE_YES_SILK_FULL_BOX = smd 0.635 x 1.27: 1 -0.813,0; 2 0,0; 3 0.813,0
PAD-JUMPER-2-NO_NO_SILK = smd 0.635 x 1.27: 1 -0.45,0; 2 0.45,0
1X07 = drill 1.016 pad 1.88 square: 1 -7.62,0 | drill 1.016 pad 1.88 octagon: 2 -5.08,0; 3 -2.54,0; 4 0,0; 5 2.54,0; 6 5.08,0; 7 7.62,0
MA05-2 = drill 1.016 octagon: 1 -5.08,-1.27; 2 -5.08,1.27; 3 -2.54,-1.27; 4 -2.54,1.27; 5 0,-1.27; 6 0,1.27; 7 2.54,-1.27; 8 2.54,1.27; 9 5.08,-1.27; 10 5.08,1.27
TSR-1 = drill 0.9 square: 1 -2.54,0; 2 0,0; 3 2.54,0
USB-B-PTH = drill 0.914 pad 1.676: D+ 0,1.25; D- 1.981,1.25; GND 0,-1.25; VBUS 1.981,-1.25 | drill 2.286: S1 -2.718,-6.02; S2 -2.718,6.02
USB-B-PTH-VERTICAL = drill 0.914 pad 1.676: D+ 4.826,4.394; D- 4.826,7.595; GND 7.315,4.394; VBUS 7.315,7.595
HC49US = drill 0.7 pad 1.651: 1 -2.54,0; 2 2.54,0

### Placement (x,y rotation side)
+5V_OK  6.35,48.67 90 top
C1  44.45,67.92 270 top
C2  33.85,51.65 90 top
C3  22.23,58.19 90 top
C4  38.39,54.44 90 top
C5  39.51,45.82 90 bottom
C6  42.06,45.94 90 bottom
C7  59.69,74.7 180 top
C8  44.45,29.39 0 top
C9  37.78,29.39 180 top
C10  80.59,62.64 0 top
C11  71.75,74.7 180 top
C12  49.53,67.92 270 top
C13  29.84,58.19 90 top
C14  83.19,74.7 180 top
C15  80.59,59.46 0 top
C16  61.54,60.1 90 top
C17  40.64,60.73 0 top
C18  52.65,60.1 90 top
C19  77.47,50.57 90 top
C20  65.41,31.52 90 top
C21  58.42,50.57 270 top
C22  59.05,14.06 180 top
C23  62.87,41.05 270 top
C24  53.34,14.06 180 top
C25  47.62,14.06 180 top
C26  41.91,14.06 180 top
C27  54.61,37.87 270 top
C28  54.61,44.22 90 top
C29  36.2,14.06 180 top
C30  64.77,14.06 180 top
C31  93.56,60.66 270 top
C32  40.84,41.86 0 bottom
D1  75.51,60.1 270 top
D2  89.08,46.27 90 top
D3  24.13,65.49 0 top
D4  34.92,57.56 270 top
D5  69.22,31.84 180 top
D6  61.91,50.25 0 top
ENCODER  40.72,8.66 180 top
F1  24.79,75.34 0 top
GND  5.08,66.15 0 top
I2C  [1X04']  75.88,8.66 180 top
IC1  86.51,55.65 90 top
IC2  25.72,58.19 0 top
IC3  40.81,44.41 0 top
IC4  57.1,60.1 180 top
IC5  67.31,41.05 0 top
ISP  26.62,21.34 270 top
L1  23.16,47.4 0 top
L2  23.16,52.48 180 top
PE  5.08,58.51 0 top
Q1  70.12,66.45 0 top
Q2  79.64,66.45 0 top
Q3  89.71,63.49 180 top
Q4  17.78,66.45 90 top
Q5  75.88,20.73 180 top
Q6  84.45,20.73 0 top
R1  72.34,60.1 270 top
R2  73.98,15.01 90 top
R3  12.7,44.86 0 top
R4  3.61,25.17 270 top
R5  7.62,25.17 270 top
R6  69.16,60.1 270 top
R7  70.17,15.01 90 top
R8  12.7,41.05 0 top
R9  75.51,65.81 270 top
R10  13.97,34.53 90 top
R11  12.19,60.55 0 top
R12  27.94,66.45 90 top
R13  12.19,56.9 0 top
R14  12.7,48.67 0 top
R15  65.35,60.1 270 top
R16  40.64,64.54 0 top
R17  34.92,64.54 0 top
R18  60.91,66.45 0 top
R19  55.19,66.45 0 top
R20  34.92,60.73 0 top
R21  49.48,60.1 90 top
R22  73.03,25.81 90 top
R23  76.83,25.81 90 top
R24  80.64,25.81 90 top
R25  73.66,50.57 270 top
R26  84.45,25.81 270 top
R27  77.47,31.52 90 top
R28  69.85,50.57 270 top
R29  73.66,31.52 90 top
R30  66.04,50.57 270 top
R31  57.78,22.63 90 top
R32  59.05,17.55 180 top
R33  77.47,37.87 90 top
R34  77.47,44.22 90 top
R35  52.07,22.63 90 top
R36  53.34,17.55 180 top
R37  73.66,44.22 90 top
R38  73.66,37.87 270 top
R39  46.35,22.63 90 top
R40  47.62,17.55 180 top
R41  58.42,44.22 90 top
R42  58.42,37.87 270 top
R43  40.64,22.63 90 top
R44  41.91,17.55 180 top
R45  34.92,22.63 90 top
R46  36.2,17.55 180 top
R47  12.7,52.48 0 top
R48  87.63,35.97 90 top
R49  11.66,25.17 90 top
R50  63.5,22.63 90 top
R51  64.77,17.55 180 top
R52  93.56,66.33 270 top
R53  22.96,15.85 90 top
R54  31.9,15.85 90 top
R55  29.06,15.85 90 top
R56  26.01,15.85 90 top
R57  19.91,15.85 90 top
RESET  6.99,33.57 180 top
ROT  20.12,91.44 270 top
RX_LEX  6.35,41.05 90 top
S1  52.44,92.61 0 top
S2  67.44,92.61 0 top
S3  82.44,92.61 0 top
SJ1  72.07,18.82 0 top
SJ2  87.07,66.65 180 bottom
SJ3  47.04,68.99 90 bottom
SOLDER_IRON  91.26,32.16 90 top
SPI1  26.62,9.75 180 top
STATUS  6.35,52.48 90 top
SW  42.2,92.61 270 top
SWITCHES  54.64,8.66 180 top
TX_LED  6.35,44.86 90 top
U1  46.99,72.8 0 top
U$1  [LOGO+]  87.3,8.33 90 top
USB  12.7,14.27 0 top
USB2  14.02,86.56 0 top
USB_ENC  7.47,91.44 90 top
USB_EXT  3.66,14.43 270 top
VCC  5.08,74.7 0 top
Y1  41.03,33.43 0 top

### Tracks (layer width: path | path; a pad name or v marks a point on that pad's centre or on a via)
+4.096V  (via drill 0.5 pad 0.3)
  Top 0.406: IC2.4 IC2.3 29.84,56.89 C13.1 v29.84,55.33 34.61,55.33 36.83,53.11 38.39,53.11 C4.1 38.41,53.05 IC3.42 | R25.1 v73.66,50.57
  Bottom 0.406: v29.84,55.33 47.02,55.33 48.9,57.21 72.97,57.21 73.61,56.58 73.61,50.57 v73.66,50.57
+5V  (via drill 0.5 pad 0.25, 0.5 pad 0.3)
  Top 0.406: IC3.34
  Top 0.813: U1.3 C12.1
  Bottom 0.406: C6.2 42.07,47.35 v44.91,47.35 | C32.2 v37.8,41.86 | v48.97,54.86 48.97,51.61 | v45.52,57.71 v45.52,59.74
  other vias: 48.97,51.82
  pour Top: 0,54.38 19.37,54.38 19.37,62.32 30.8,62.32 30.8,68.67 86.78,68.67 86.78,58.42 86.77,58.42 86.77,52.83 86.78,35.04 94.78,35.04 94.78,5.49 -0.03,5.49
+12V
  Top 0.406: R9.1 75.51,67.55 Q2.3 87.05,67.55 87.78,68.28 | C1.1 42.06,66.93 R16.2
  Top 0.61: Q3.3 89.08,68 89,68.07 | Q3.2 90.35,67.74 90.22,67.87 | Q3.1 91.62,67.84 91.64,67.87
  Top 0.813: C1.1 U1.1
  pour Top: 26.44,80.42 26.44,62.95 30.16,62.95 30.16,69.3 94.78,69.3 94.78,80.42
  pour Top: 87.46,67.74 94.78,67.74 94.78,70.89 87.46,70.89
  pour Top: 32.72,78.84 32.72,71.32 39.22,71.32 39.22,78.84
AVCC
  Top 0.406: L1.P$2 25.7,47.71 27.3,47.71 29.84,50.25 C2.1 36.76,50.25 IC3.44 36.8,49.21 44.81,41.21 IC3.24 | IC3.24
CS  (via drill 0.6)  (1 unrouted)
  Top 0.406: R56.2 24.79,17.27 24.38,16.46 v24.38,15.85 | v17.27,24.18 17.27,25.4 17.68,25.81 22.35,25.81 22.96,26.42 22.96,42.88
  Bottom 0.406: v24.38,15.85 19.1,15.85 17.88,16.87 17.88,23.77 v17.27,24.18
D+  (via drill 0.5 pad 0.3)
  Top 0.406: R4.1 v3.61,25.15 | IC3.4 | IC3.4 v29.92,46.01
  Bottom 0.406: v3.61,25.15 29.29,25.15 29.92,25.78 v29.92,46.01
D-  (via drill 0.5 pad 0.3)
  Top 0.406: R5.1 7.62,26.44 v9.64,26.44 | IC3.3 | IC3.3 v28.49,46.81
  Bottom 0.406: v28.49,46.81 28.49,27.08 27.85,26.44 v9.64,26.44
DC  (via drill 0.6)
  Top 0.406: R55.2 | R55.2 v30.48,15.85 | v39.42,27.64 v46.53,27.64 | v39.22,51.61 39.22,50.22 IC3.41
  Bottom 0.406: v30.48,15.85 38.61,15.85 39.01,16.26 39.01,27.23 v39.42,27.64 | v46.53,27.64 47.14,27.64 47.75,28.25 47.75,38.41 46.74,39.42 46.74,50.19 45.31,51.61 v39.22,51.61
GND  (via drill 0.5 pad 0.3)
  Top 0.406: IC2.5 24.77,59.59 C3.2 v22.23,58.19 | C13.2 v29.84,58.19 | R17.1 v31.75,64.54 | C17.2 v40.64,60.73 | D4.1 arc90 D4.1 v32.07,58.51 | STATUS.C v6.54,52.48 | +5V_OK.C v6.54,48.67 | v72.34,60.1 R1.1 | IC1.5 82.63,57.56 81.99,58.19 C15.2 81.86,59.46 v81.86,61.05 81.86,62.64 C10.2 | v55.19,66.45 R19.1 arc-90 53.92,66.32 | C16.2 v61.54,60.1 | IC4.4 v55.19,64.54 | C25.2 46.23,13.74 46.35,13.74 46.33,13.72 v46.33,12.19 | 70.17,32.92 D5.1 v70.17,34.38 | R29.2 v73.66,31.5 | C20.2 v65.41,31.5 | R33.1 v77.47,37.9 | R34.2 v77.47,44.2 | R30.2 v66.04,50.6 | D6.1 60.96,49.17 C21.2 v58.42,50.6 | C28.2 v54.61,44.2 | C27.2 v54.61,37.9 | C23.2 v62.87,41.07 | IC5.4 69.22,38.51 v70.48,38.51 | C9.1 v40.64,29.39 C8.1 | IC3.35 v44.01,48.41 | v44.01,48.41 | IC3.33 | IC3.5 | IC3.5 v36.8,45.21 | IC3.15 v39.2,40.21 | v39.2,40.21 | IC3.23 v44.01,40.41 | C4.2 38.42,55.84 v38.42,54.41 | IC3.43 | IC3.43 v37.6,51.61 | IC3.33 v48.81,48.41 | C2.2 v33.85,51.65 | v48.81,48.41 | C19.2 v77.47,50.57 | Q1.2 71.12,65.39 v71.12,63.91 | R22.1 v73.03,25.81 | SOLDER_IRON.6 87.78,37.24 R48.2 | C29.2 34.75,14.01 v34.75,12.19 | C26.2 40.54,14.03 v40.54,12.19 | C24.2 51.82,13.94 v51.82,12.19 | C22.2 57.61,14.01 v57.61,12.19 | C30.2 63.4,14.03 v63.4,12.19 | Q5.2 v74.93,23.31
  Top 0.61: 18.09,64.62 18.16,64.54 Q4.1 22.07,64.54 22.15,64.62 | Q4.2 18.06,65.81 17.88,65.63 | Q4.3 17.91,67.08 17.88,67.06
  Top 0.813: C1.2 44.45,66.45 v46.99,66.45 49.53,66.45 C12.2
  Top 1.016: 88.95,50.44 v89.08,50.57 D2.A
  Top 1.27: D2.A 88.95,48.47
  Bottom 0.406: SJ3.1 SJ3.2
  other vias: 17.78,77.88 87.96,50.57 90.22,50.57 89.08,51.87 87.96,51.84 19.05,77.88 20.32,77.88 20.32,76.61 19.05,76.61 17.78,76.61 17.78,75.34 19.05,75.34 20.32,75.34 20.32,74.07 19.05,74.07 17.78,74.07 17.78,72.8 19.05,72.8 20.32,72.8 20.32,71.53 19.05,71.53 17.78,71.53 90.22,51.87 21.59,77.88 21.59,76.61 21.59,75.34 21.59,74.07 21.59,72.8 21.59,71.53 22.86,71.53 22.86,72.8 22.86,74.07 22.86,75.34 22.86,76.61 22.86,77.88 24.13,71.53 24.13,72.8 24.13,74.07 24.13,75.34 24.13,76.61 24.13,77.88
  pour Bottom: 0.09,69.94 16.19,69.94 16.19,68.67 86.77,68.67 86.77,35.04 94.78,35.04 94.78,5.49 0,5.49
  pour Bottom: 16.87,80.42 94.78,80.42 94.78,35.79 87.46,35.79 87.46,69.3 16.87,69.3
  pour Top: 16.83,68.95 16.83,80.42 22.3,80.42 22.3,68.95
  pour Top: 22,62.95 24.77,62.95 24.77,80.42 22,80.42
  pour Top: 12.93,55.02 18.73,55.02 18.73,69.39 16.83,69.39 16.83,58.51 12.93,58.51
  pour Top: 87.46,52.48 87.46,50.14 90.65,50.14 90.65,52.48
GND1
  Top 0.406: SOLDER_IRON.5 88.32,34.7 88.16,34.54 R48.1
HEATER_VCC
  Top 0.61: IC1.2 91.24,55.02 91.24,54.86 | IC1.1 91.03,53.75 91.03,53.85
  Top 1.016: D2.C 89.08,41.94 89,41.86
  Top 1.27: D2.C 89,44.07
  pour Top: 90.61,55.33 90.61,53.11 91.29,53.11 91.29,42.44 87.46,42.44 87.46,35.78 94.78,35.78 94.78,55.33
I_HEATER_ADC
  Top 0.406: IC3.39 40.8,57.05 42.46,58.7 R21.1 C18.1 52.65,57.56 53.29,56.92 55.19,56.92 IC4.5 55.19,59.11 55.83,59.74 58.37,59.74 59,60.38 IC4.1
LED_STATUS  (via drill 0.5 pad 0.3)
  Top 0.406: IC3.12 | R47.2 v12.7,52.48 | IC3.12 36.8,37.85 36.17,37.21 v27.2,37.21
  Bottom 0.406: v27.2,37.21 18.24,37.21 17.6,37.85 17.6,51.84 16.97,52.48 v12.7,52.48
MISO  (via drill 0.5 pad 0.3)
  Top 0.406: IC3.11 v26.4,40.41 | v21.54,40.41 ISP.9
  Bottom 0.406: v21.54,40.41 v26.4,40.41
MOSI  (via drill 0.5 pad 0.3)
  Top 0.406: IC3.10 | IC3.10 v33.02,41.21 | v31.75,27.7 31.7,27.62 ISP.1 31.75,22.55 32.51,22.55 33.33,21.74 33.33,19.1 31.9,17.68 R54.2
  Bottom 0.406: v33.02,41.21 32.38,41.21 31.75,40.58 v31.75,27.7
N$1
  Top 0.61: Q4.8 12.88,64.54 12.8,64.62 | Q4.7 12.62,65.81 12.6,65.84 | Q4.6 13.18,67.08 13.01,67.26 | Q4.5 12.68,68.35 12.6,68.28
  pour Top: 0,69.94 13.55,69.94 13.55,63.27 0,63.27
  pour Top: 12.93,63.7 12.93,59.14 16.19,59.14 16.19,63.7
  pour Top: 1.83,69.49 1.83,63.6 8.94,63.6 8.94,69.49
N$2
  Top 0.61: Q4.4 23.5,68.35 24.13,67.72 D3.3 26.37,66.59 R12.1
N$3
  Top 0.406: Q2.1 78.69,65.05 78.06,64.41 R9.2 | R9.2 75.51,64.54 74.24,64.54 71.24,67.55 Q1.3 | D1.C R9.2
N$4
  Top 0.406: Q1.1 R6.1
N$5
  pour Bottom: 0,80.42 0,70.57 16.19,70.57 16.19,80.42
  pour Bottom: 1.83,78.84 1.83,71.53 15.65,71.53 15.65,78.84
  pour Top: 0,80.42 0,70.57 16.19,70.57 16.19,80.42
  pour Top: 1.83,78.84 1.83,71.53 15.65,71.53 15.65,78.84
N$6
  Top 0.406: R8.1 RX_LEX.A
N$7
  Bottom 1.016: SW.4 47.52,88.8 48.79,90.07 S1.4 S1.3 S2.4 S2.3 S3.4 S3.3
N$8
  Bottom 1.016: SW.1 47.52,96.42 48.79,95.15 S1.1 S1.2
N$9
  Top 0.406: R4.2 3.66,23.7 USB_EXT.1 5.54,18.24 8.25,15.53 USB.D+
N$10
  Top 0.406: 7.64,23.27 7.62,23.27 | 7.64,23.27 7.64,23.75 R5.2 | 7.64,23.27 7.64,18.31 8.28,17.68 14.05,17.68 14.68,17.04 USB.D- 14.68,14.96 14.05,14.33 6.81,14.33 5.44,15.7 USB_EXT.2
N$11
  Top 0.406: R16.1 R17.2 35.56,64.54 34.92,63.91 34.92,61.37 34.29,60.73 R20.1
N$12
  Bottom 1.016: S2.2 S2.1 64.75,95.3 62.59,95.3 60.71,93.42 47.4,93.42 46.94,93.88 SW.2
N$13
  Bottom 1.016: S3.2 S3.1 79.85,95.1 77.83,95.1 74.47,91.75 47.24,91.75 46.84,91.34 SW.3
N$14
  Top 0.406: SJ1.3 73.34,18.82 73.98,18.19 R2.2
N$15
  Top 0.406: 80.64,19.73 Q6.1 | R24.1 80.64,19.73 | 80.64,19.73 75.98,19.73 Q5.3
N$16
  Top 0.406: C15.1 79.19,56.92 79.83,56.29 IC1.6
N$17
  Top 0.406: Q5.1 R23.1
N$18
  Top 0.406: R18.1 R19.2 arc90 56.46,66.32 IC4.3
N$19
  Top 0.406: R3.1 TX_LED.A
N$20
  Top 0.406: IC1.7 65.99,55.02 65.35,55.65 R15.2
N$21
  Top 0.406: R21.2 C18.2 arc90 53.42,60.73 57.1,60.73 57.73,61.37 IC4.2 57.73,63.91 58.37,64.54 64.72,64.54 65.35,63.91 R15.1
N$22
  Top 0.406: R27.1 R29.1 71.12,30.12 70.5,30.74 D5.3 67.31,30.74 | C20.1 66.69,30.12 67.31,30.74 | 67.31,30.74 67.31,34.7 67.94,35.33 IC5.3
N$23
  Top 0.406: Q6.3 R26.2
N$24
  Top 0.406: R33.2 R38.1 72.39,39.27 71.25,40.41 67.31,40.41 66.67,39.78 IC5.2
N$25
  Top 0.406: C21.1 59.71,51.97 60.33,51.35 D6.3 63.5,51.35 64.12,51.97 R30.1 R28.1 67.94,51.97 67.94,48.03 69.22,46.76 IC5.5
N$26
  Top 0.406: 87.81,65.45 Q3.4 81.23,66.09 Q2.2 80.59,61.69 79.96,61.05 78.69,61.05 78.05,61.05 77.42,60.41 77.42,59.14 76.78,58.51 75.51,58.51 D1.A
N$27
  Top 0.406: R34.1 R37.1 72.26,42.82 71.12,41.68 68.58,41.68 67.94,42.32 IC5.6
N$28
  Top 0.61: IC1.3 91.85,56.29 91.85,56.49 | IC1.4 91.24,57.56 91.24,57.51 | Q3.6 89.08,59 89,58.93 | Q3.7 90.35,59.05 90.22,58.93 | Q3.8 91.62,59.16 91.64,59.13 | Q3.5 87.81,58.95 87.78,58.93
  pour Top: 94.78,59.33 87.48,59.33 87.48,58.32 90.63,58.32 90.61,55.97 94.78,55.97
N$29
  Top 0.406: SJ1.1 70.8,18.82 70.17,18.19 R7.2
N$30
  Top 0.406: IC2.2 IC2.1 22.23,56.89 C3.1 21.26,56.79 20.62,56.16 L2.P$2
N$31
  Top 0.406: USB_EXT.3 10.21,13.16 11.99,11.38 13.99,11.38 14.63,12.01 14.63,13.03 USB.VBUS 16.43,13.03 17.07,13.66 17.07,23.14 16.43,23.77 11.68,23.77 R49.1
N$32
  Top 0.406: R47.1 STATUS.A
N$33
  Top 0.406: R14.1 +5V_OK.A
N$34
  Top 0.406: IC4.6 IC4.7
N$35  (via drill 0.6)
  Top 0.406: R53.1 22.96,13.41 22.35,12.8 v20.73,12.8
  Bottom 0.406: v20.73,12.8 20.12,12.8 19.3,11.99 19.3,8.13 20.73,6.71 28.65,6.71 29.26,7.32 29.26,8.38 SPI1.4
N$36
  Top 0.406: R54.1 31.9,13.01 31.5,12.6 27.23,12.6 26.62,12.19 SPI1.5
N$37  (via drill 0.6)
  Top 0.406: R55.1 28.45,14.43 v27.53,13.41 | v30.07,6.71 27.23,6.71 26.62,7.32 SPI1.6
  Bottom 0.406: v27.53,13.41 27.53,13.01 27.84,12.6 32.72,12.6 33.73,11.58 33.73,7.52 32.92,6.71 v30.07,6.71
N$38
  Top 0.406: SPI1.7 24.08,12.29 24.59,12.8 25.6,12.8 26.01,13.21 R56.1
N$39
  Top 1.422: R52.2 C31.1
N$40
  Top 0.406: SPI1.8 24.08,7.42 23.37,6.71 19.51,6.71 18.49,7.72 18.49,13.01 19.1,13.61 19.1,13.62 R57.1
N$42  (via drill 0.5 pad 0.3)
  Top 0.406: IC5.1 v65.41,36.6 65.41,36.47 R42.2 | R38.2 v73.66,37.87
  Bottom 0.406: v65.41,36.6 73.03,36.6 73.66,37.24 v73.66,37.87
N$43  (via drill 0.5 pad 0.3)
  Top 0.406: R37.2 v73.66,44.22 | IC5.7 v66.67,45.49 66.67,45.62 R41.2
  Bottom 0.406: v66.67,45.49 73.03,45.49 73.66,44.86 v73.66,44.22
PE
  pour Top: 0,62.64 0,55.02 11.66,55.02 11.66,62.64
  pour Top: 1.63,61.77 1.63,55.27 8.33,55.27 8.33,61.77
PWM  (via drill 0.5 pad 0.3)
  Top 0.406: R1.2 69.16,58.67 R6.2 69.16,59.46 68.53,60.1 64.08,60.1 63.45,59.46 63.45,56.08 62.81,55.45 v50.41,55.45 | IC3.30 | IC3.30 v47.99,46.01
  Bottom 0.406: v47.99,46.01 49.77,46.01 50.41,46.65 v50.41,55.45
RESET  (via drill 0.5 pad 0.3)
  Top 0.406: IC3.13 | R10.1 13.97,31.94 13.34,31.3 RESET.1 | IC3.13 37.6,35.45 36.97,34.81 27.3,34.81 26.67,34.18 v26.67,31.28 26.62,31.23 ISP.5
  Bottom 0.406: RESET.1 26.67,31.3 v26.67,31.28
ROT_1
  Top 0.406: IC3.28 48.86,44.41 49.7,43.57 49.7,19.96 49.05,19.32 R40.1 49.05,14.38 49.02,14.35 C25.1
ROT_2
  Top 0.406: IC3.27 48.63,43.61 49.06,43.18 49.06,27.1 48.02,26.06 44.37,26.06 43.33,25.02 R44.1 43.33,14.38 43.31,14.35 C26.1
ROT_3
  Top 0.406: IC3.25 47.79,42.01 48.42,41.38 48.42,27.33 47.79,26.7 38.25,26.7 37.62,26.06 R46.1 37.62,14.38 37.59,14.35 C29.1
ROT_A_D+
  Bottom 1.016: 17.58,87.88 ROT.A | USB2.D+ 17.58,89.69 17.58,87.88 | 17.58,87.88 17.32,87.63 USB_ENC.1
ROT_B_D-
  Top 1.016: USB_ENC.2 10.77,90.17 13.31,87.63 16.66,87.63 | 16.66,87.63 22.02,87.63 22.66,87 ROT.B | USB2.D- 17.3,94.16 16.66,93.52 16.66,87.63
ROT_C_GND
  Bottom 1.016: ROT.C 20.12,87.99 21.34,89.2 USB2.GND 19.74,92.56 17.58,92.56 16.26,93.88 16.26,95.25 | USB_ENC.4 16.26,95.25 | ROT.SW- 16.26,97.1 16.26,95.25
ROT_EXT_1
  Top 0.406: R39.1 46.2,21.06 R40.2 46.99,17.55 47.62,16.92 47.62,11.61 46.99,10.97 45.11,10.97 44.53,10.39 ENCODER.1
ROT_EXT_2
  Top 0.406: R43.1 40.49,21.06 R44.2 41.35,17.55 41.99,16.92 ENCODER.2
ROT_EXT_3
  Top 0.406: R45.1 34.77,21.06 R46.2 35.56,17.55 36.2,16.92 36.2,12.22 36.83,11.58 38.81,11.58 39.45,10.95 ENCODER.3
ROT_SW_VBUS
  Top 1.016: USB_ENC.3 10.77,92.71 13.89,95.83 21.34,95.83 | 21.34,95.83 22.66,97.16 ROT.SW+ | USB2.VBUS 21.34,95.83
RX_LED  (1 unrouted)
  Top 0.406: RX_LEX.C 4.6,39.78 5.24,39.14 17.77,39.14 21.44,42.81 35.01,42.81
SCK  (via drill 0.6)
  Top 0.406: IC3.9 | IC3.9 24.77,42.01 24.08,41.33 24.08,24.28 | 24.08,24.28 ISP.7 | R53.2 22.56,17.27 v21.34,18.49 | v22.96,24.28 24.08,24.28
  Bottom 0.406: v21.34,18.49 19.3,18.49 18.69,19.1 18.69,23.77 19.3,24.28 v22.96,24.28
SCL  (via drill 0.5 pad 0.3)
  Top 0.406: v70.17,15.01 R7.1 68.9,13.59 68.26,12.95 I2C.4 | IC3.18 v41.6,37.21 | v41.6,37.21
  Bottom 0.406: v41.6,37.21 41.6,15.65 42.24,15.01 v70.17,15.01
SDA  (via drill 0.5 pad 0.3)
  Top 0.406: IC3.19 v42.41,36.41 | v42.41,36.41 | v73.98,15.01 R2.1 72.57,13.59 71.93,12.95 71.93,11.58 70.8,10.45 I2C.3
  Bottom 0.406: v42.41,36.41 44.97,36.41 45.61,35.78 45.61,17.04 46.24,16.41 73.34,16.41 73.98,15.77 v73.98,15.01
SENSOR_1
  Top 0.406: SOLDER_IRON.4 83.77,32.16 83.13,32.79 83.13,48.54 82.5,49.17 C19.1 R25.2 R28.2
SENSOR_2  (via drill 0.5 pad 0.3)
  Top 0.406: SOLDER_IRON.2 84.45,27.08 R26.1 84.45,29.38 81.04,32.79 v80.01,32.79 77.47,32.79 R27.2 | v80.01,53.21 80.01,53.38 79.38,54.01 43.69,54.01 41.6,51.93 IC3.38
  Bottom 0.406: v80.01,53.21 v80.01,32.79
STAND
  Top 0.406: R23.2 73.03,27.21 R22.2 61.7,27.23 61.06,27.86 61.06,33.12 59.84,34.34 52.27,34.34 51.6,35.01 51.6,44.64 48.63,47.61 IC3.32
SW_1  (via drill 0.5 pad 0.3)
  Top 0.406: C30.1 66.17,17.53 R51.1 66.45,17.81 v66.45,24.99 | v48.02,42.84 47.99,42.81 IC3.26
  Bottom 0.406: v66.45,24.99 51.84,24.99 51.21,25.63 51.21,42.18 50.57,42.81 48.04,42.81 v48.02,42.84
SW_2
  Top 0.406: IC3.31 48.5,46.81 50.97,44.35 50.97,34.78 52.01,33.74 59.64,33.74 60.48,32.91 R32.1 60.48,14.38 60.45,14.35 C22.1
SW_3
  Top 0.406: C24.1 54.74,17.55 | 54.74,17.55 R36.1 | 54.74,17.55 54.74,32.47 54.1,33.11 51.78,33.11 50.33,34.56 50.33,43.97 49.09,45.21 IC3.29
SW_EXT_1
  Top 0.406: R50.1 63.35,21.06 R51.2 64.14,17.55 64.77,16.92 64.77,11.61 64.14,10.97 59.08,10.97 58.45,10.34 SWITCHES.1
SW_EXT_2
  Top 0.406: R31.1 57.63,21.06 R32.2 58.65,17.55 59.13,17.07 59.13,12.45 57.89,11.2 56.54,11.2 55.91,10.57 SWITCHES.2
SW_EXT_3
  Top 0.406: R35.1 51.92,21.06 R36.2 52.73,17.55 53.37,16.92 SWITCHES.3
T_COMP_ADC
  Top 0.406: R41.1 56.33,42.82 | 56.33,42.82 C28.1 | IC3.37 42.41,51.77 44.08,53.44 55.69,53.44 56.33,52.81 56.33,42.82
T_HEATER_ADC
  Top 0.406: R42.1 C27.1 53.44,39.27 52.81,39.91 52.81,52.2 52.17,52.83 44.3,52.83 43.2,51.74 IC3.36
TX_LED  (via drill 0.5 pad 0.3)
  Top 0.406: 4.45,44.86 TX_LED.C 3.17,44.86 2.54,44.22 2.54,39.14 3.17,38.51 v19.28,38.51 | IC3.22 v44.8,37.21 v44.81,37.21 | v25.72,38.51 v35.56,38.51
  Bottom 0.406: v19.28,38.51 v25.72,38.51 | v35.56,38.51 44.17,38.51 44.81,37.87 v44.81,37.21
U_IN_ADC
  Top 0.406: C17.1 R20.2 36.2,60.73 36.2,57.56 D4.3 39.37,57.56 40.01,56.92 IC3.40
UCAP  (via drill 0.5 pad 0.25)
  Top 0.406: IC3.6 v37.69,44.4
  Bottom 0.406: v37.69,44.4 37.72,44.42 C5.1
UVCC  (via drill 0.5 pad 0.3)
  Top 0.406: IC3.2 | R49.2 20.17,26.59 20.93,27.36 20.93,38.2 20.6,38.53 v20.6,39.61 20.83,39.59 | IC3.2 | IC3.2 v33.6,47.61 | IC3.7 | IC3.7 v36.8,43.61
  Bottom 0.406: v36.8,43.61 34.24,43.61 33.6,44.25 v33.6,47.61 33.6,47.78 32.97,48.41 21.44,48.41 20.6,47.57 v20.6,39.61
XTAL1
  Top 0.406: C8.2 45.85,32.79 45.22,33.43 Y1.2 41.44,33.43 40.8,34.06 IC3.17
XTAL2
  Top 0.406: C9.2 36.38,32.79 37.02,33.43 Y1.1 39.37,33.43 40.01,34.06 IC3.16

### Text on the board
tPlace: S1 | GND | S2 | VUSB | SW | S3 | D- | B | GND | D+ | A | 1 | WMPR / SOLDER / STATION | 1 | 1 | 5 | 4 | 7 | 2 | 1 | 1 | 1 | 6 | 03/2015